# EAGLE schematic untitled (EAGLE 8.7.0)
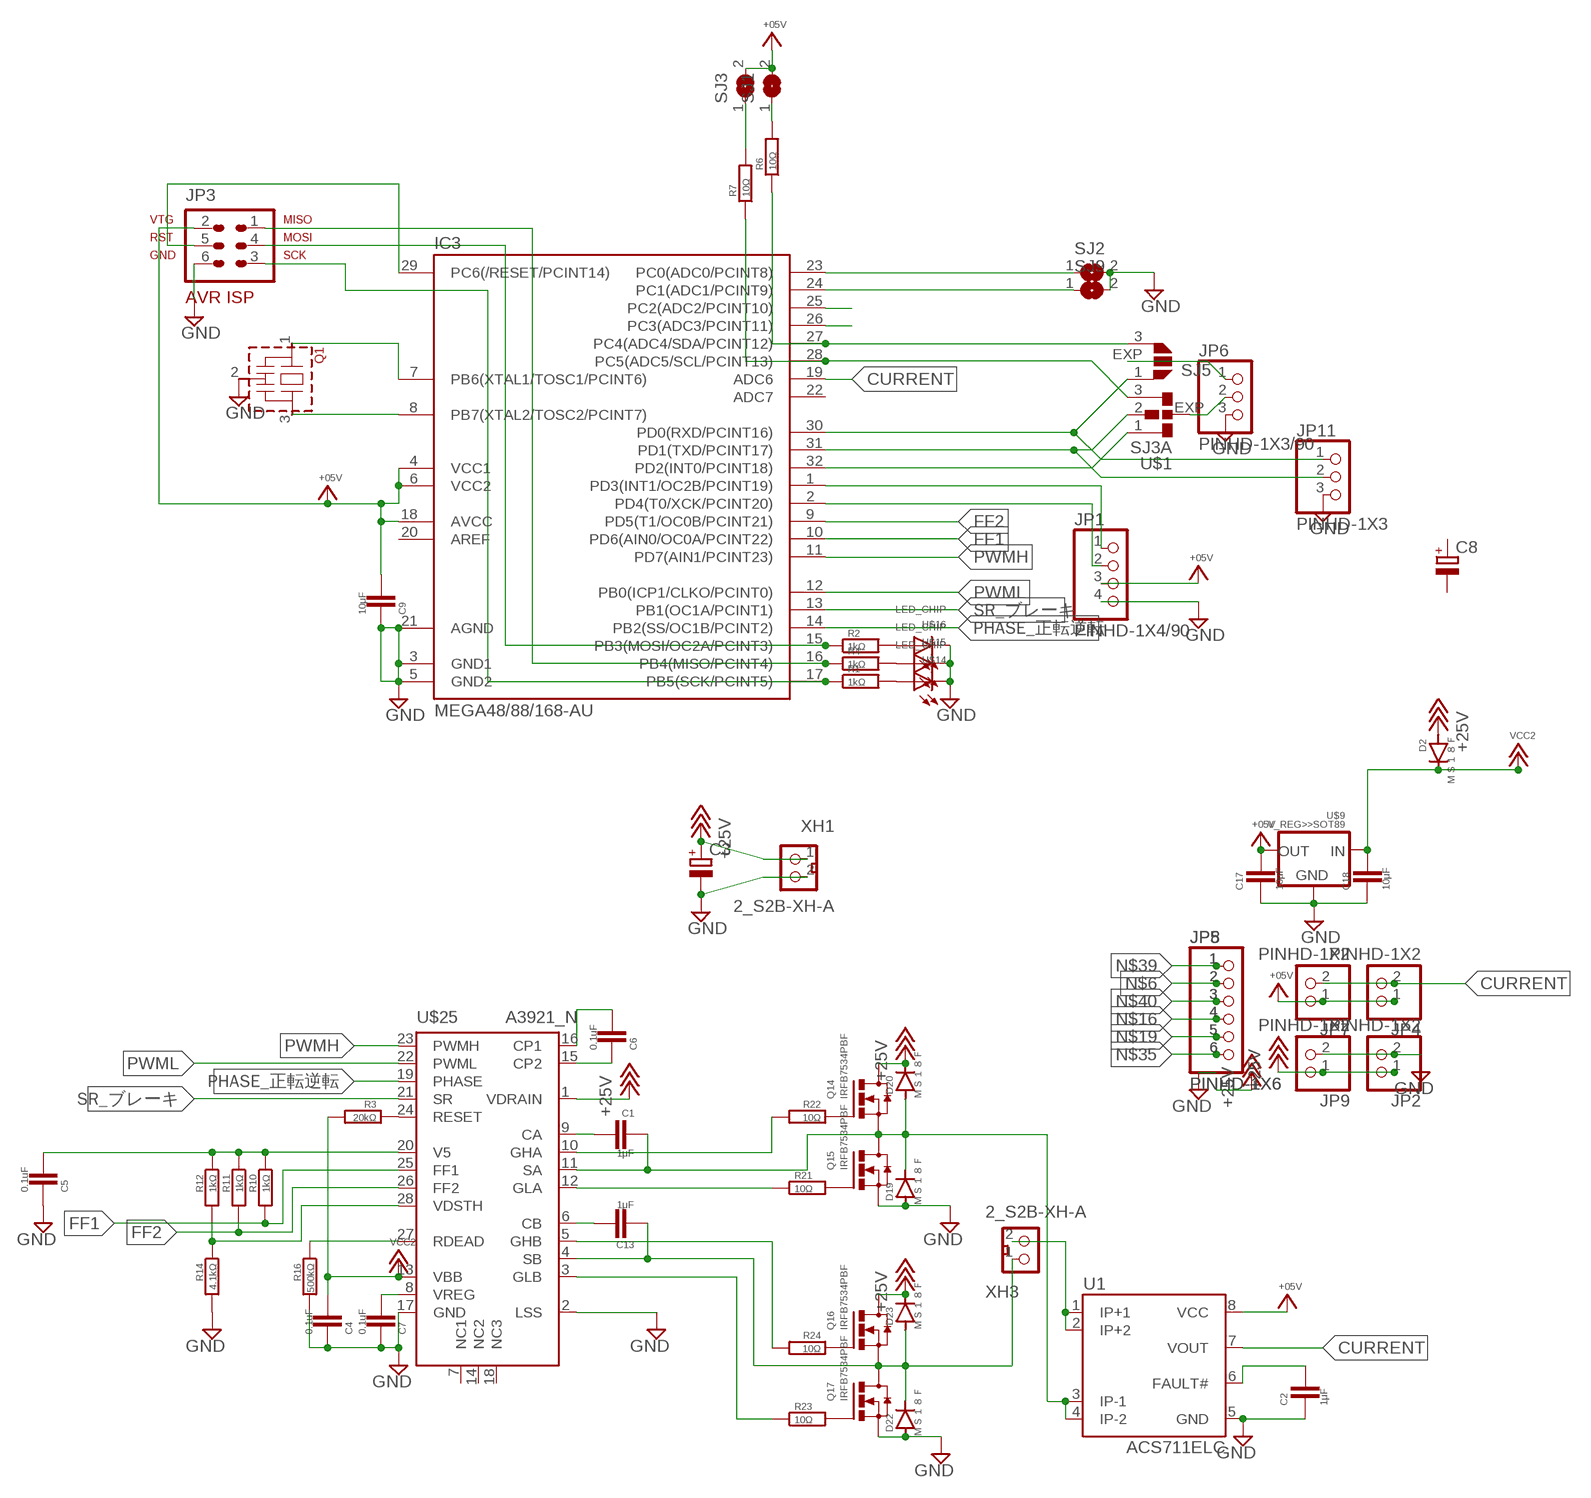
[diagram p0: schematic, sheet 1]

## Parts
C1  1μF  CAPACITOR>>2012  [2012]
C2  1μF  CAPACITOR>>2012  [2012]
C3  CPOL-EUUD-6,3X8,8  [UD-6,3X5,8_NICHICON]
C4  0.1uF  CAPACITOR>>2012  [2012]
C5  0.1uF  CAPACITOR>>2012  [2012]
C6  0.1uF  CAPACITOR>>2012  [2012]
C7  0.1uF  CAPACITOR>>2012  [2012]
C8  CPOL-EU150CLZ-1010  [150CLZ-1010]
C9  10μF  CAPACITOR>>2012  [2012]
C13  1μF  CAPACITOR>>2012  [2012]
C17  10μF  CAPACITOR>>2012  [2012]
C18  10μF  CAPACITOR>>2012  [2012]
D2  ＭＳ１８Ｆ  DIODE>>MS18F  [MS18F]
D19  ＭＳ１８Ｆ  DIODE>>MS18F  [MS18F]
D20  ＭＳ１８Ｆ  DIODE>>MS18F  [MS18F]
D22  ＭＳ１８Ｆ  DIODE>>MS18F  [MS18F]
D23  ＭＳ１８Ｆ  DIODE>>MS18F  [MS18F]
IC3  MEGA48/88/168-AU  [TQFP32-08]
JP1  PINHD-1X4/90  [1X04/90]
JP2  PINHD-1X2  [1X02]
JP3  AVR-ISP-6  [AVR-ISP-6]
JP4  PINHD-1X2  [1X02]
JP5  PINHD-1X6  [1X06]
JP6  PINHD-1X3/90  [1X03/90]
JP7  PINHD-1X2  [1X02]
JP8  PINHD-1X6  [1X06]
JP9  PINHD-1X2  [1X02]
JP11  PINHD-1X3  [1X03]
Q1  CSTLS_G  [CSTLS_G8]
Q14  IRFB7534PBF  MOSFET_N>>TO252  [TO252]
Q15  IRFB7534PBF  MOSFET_N>>TO252  [TO252]
Q16  IRFB7534PBF  MOSFET_N>>TO252  [TO252]
Q17  IRFB7534PBF  MOSFET_N>>TO252  [TO252]
R1  1kΩ  REGISTER>>2012  [2012]
R2  1kΩ  REGISTER>>2012  [2012]
R3  20kΩ  REGISTER>>2012  [2012]
R4  1kΩ  REGISTER>>2012  [2012]
R6  10Ω  REGISTER>>2012  [2012]
R7  10Ω  REGISTER>>2012  [2012]
R10  1kΩ  REGISTER>>2012  [2012]
R11  1kΩ  REGISTER>>2012  [2012]
R12  1kΩ  REGISTER>>2012  [2012]
R14  4.1kΩ  REGISTER>>2012  [2012]
R16  500kΩ  REGISTER>>2012  [2012]
R21  10Ω  REGISTER>>2012  [2012]
R22  10Ω  REGISTER>>2012  [2012]
R23  10Ω  REGISTER>>2012  [2012]
R24  10Ω  REGISTER>>2012  [2012]
SJ1  SJSS  [SJ_B]
SJ2  SJSS  [SJ_B]
SJ3  SJSS  [SJ_B]
SJ5  SJ2  [SJ2_A]
SJ9  SJSS  [SJ_B]
U1  ACS711ELC  [SOIC8]
U$1  SJ3A  [SJ3_A]
U$9  V_REG>>SOT89  [SOT89]
U$14  LED_CHIP  [2012]
U$15  LED_CHIP  [2012]
U$16  LED_CHIP  [2012]
U$25  A3921_N  [TSSOP28_N]
XH1  2_S2B-XH-A  [S2B-XH-A]
XH3  2_S2B-XH-A  [S2B-XH-A]

## Nets
+5V: C9.1 C17.1 IC3.4(VCC1) IC3.6(VCC2) IC3.18(AVCC) JP1.3 JP3.2 JP4.1 JP7.1 SJ1.2 SJ3.2 U1.8(VCC) U$9.1(OUT) ; supply symbol labelled +05V
+18V: C3.+ D2.P$1(A) D20.P$2(C) D23.P$2(C) JP2.1 JP9.1 Q14.3(D) Q16.3(D) U$25.1(VDRAIN) XH1.1 ; supply symbol labelled +25V
CURRENT: IC3.19(ADC6) JP4.2 JP7.2 U1.7(VOUT)
FF1: IC3.10(PD6(AIN0/OC0A/PCINT22)) R10.2 U$25.25(FF1)
FF2: IC3.9(PD5(T1/OC0B/PCINT21)) R11.2 U$25.26(FF2)
GND: C2.2 C3.- C4.2 C5.2 C7.2 C9.2 C17.2 C18.2 D19.P$1(A) D22.P$1(A) IC3.3(GND1) IC3.5(GND2) IC3.21(AGND) JP1.4 JP2.2 JP3.6 JP6.3 JP9.2 JP11.3 Q1.2(VSS) Q15.2(S) Q17.2(S) R14.2 R16.2 SJ2.2 SJ9.2 U1.5(GND) U$9.2(GND) U$9.2.1(GND) U$14.P$2(C) U$15.P$2(C) U$16.P$2(C) U$25.2(LSS) U$25.17(GND) XH1.2
N$1: IC3.1(PD3(INT1/OC2B/PCINT19)) JP1.1
N$2: R6.2 SJ1.1
N$3: U1.1(IP+1) U1.2(IP+2) XH3.2
N$4: C6.1 U$25.16(CP1)
N$5: IC3.29(PC6(/RESET/PCINT14)) JP3.5
N$6: C13.2 D22.P$2(C) D23.P$1(A) JP5.2 JP8.2 Q16.2(S) Q17.3(D) U$25.4(SB) XH3.1
N$7: IC3.7(PB6(XTAL1/TOSC1/PCINT6)) Q1.1
N$8: IC3.8(PB7(XTAL2/TOSC2/PCINT7)) Q1.3
N$9: R1.2 U$14.P$1(A)
N$10: IC3.2(PD4(T0/XCK/PCINT20)) JP1.2
N$11: IC3.17(PB5(SCK/PCINT5)) JP3.3 R1.1
N$14: C1.1 U$25.9(CA)
N$15: R4.2 U$15.P$1(A)
N$16: JP5.4 JP8.4 R22.2 U$25.10(GHA)
N$17: R2.2 U$16.P$1(A)
N$18: JP6.2 U$1.EXP
N$19: C1.2 D19.P$2(C) D20.P$1(A) JP5.5 JP8.5 Q14.2(S) Q15.3(D) U1.3(IP-1) U1.4(IP-2) U$25.11(SA)
N$20: R7.2 SJ3.1
N$21: IC3.15(PB3(MOSI/OC2A/PCINT3)) JP3.4 R2.1
N$22: IC3.16(PB4(MISO/PCINT4)) JP3.1 R4.1
N$23: JP6.1 SJ5.EXP
N$24: IC3.32(PD2(INT0/PCINT18)) U$1.1
N$25: IC3.23(PC0(ADC0/PCINT8)) SJ2.1
N$26: IC3.24(PC1(ADC1/PCINT9)) SJ9.1
N$27: IC3.31(PD1(TXD/PCINT17)) JP11.2 U$1.2
N$28: IC3.30(PD0(RXD/PCINT16)) JP11.1 SJ5.1
N$29: C6.2 U$25.15(CP2)
N$30: IC3.28(PC5(ADC5/SCL/PCINT13)) R7.1 U$1.3
N$31: IC3.27(PC4(ADC4/SDA/PCINT12)) R6.1 SJ5.3
N$32: IC3.25(PC2(ADC2/PCINT10))
N$33: IC3.26(PC3(ADC3/PCINT11))
N$35: JP5.6 JP8.6 R21.1 U$25.12(GLA)
N$36: R3.1 U$25.24(RESET)
N$37: C7.1 U$25.8(VREG)
N$39: JP5.1 JP8.1 R24.2 U$25.5(GHB)
N$40: JP5.3 JP8.3 R23.1 U$25.3(GLB)
N$41: C13.1 U$25.6(CB)
N$43: R12.2 R14.1 U$25.28(VDSTH)
N$50: Q15.1(G) R21.2
N$51: R16.1 U$25.27(RDEAD)
N$52: C2.1 U1.6(FAULT#)
N$54: Q14.1(G) R22.1
N$56: Q17.1(G) R23.2
N$60: Q16.1(G) R24.1
PHASE_正転逆転: IC3.14(PB2(SS/OC1B/PCINT2)) U$25.19(PHASE)
PWMH: IC3.11(PD7(AIN1/PCINT23)) U$25.23(PWMH)
PWML: IC3.12(PB0(ICP1/CLKO/PCINT0)) U$25.22(PWML)
SR_ブレーキ: IC3.13(PB1(OC1A/PCINT1)) U$25.21(SR)
V5: C5.1 R10.1 R11.1 R12.1 U$25.20(V5)
VCC2: C4.1 C18.1 D2.P$2(C) R3.2 U$9.3(IN) U$25.13(VBB)
Unconnected: C8.+ C8.- IC3.20(AREF) IC3.22(ADC7) U$25.7(NC1) U$25.14(NC2) U$25.18(NC3)

## Library data of the parts
C1 C2 C4-C7 C9 C13 C17 C18 = !SMD:CAPACITOR>>
C3 C8 = !rcl:CPOL-EU: POLARIZED CAPACITOR, European symbol
D2 D19 D20 D22 D23 = !diode:DIODE>>: DIODE
IC3 = !avr:MEGA48/88/168
JP1 = !pinhead(ﾋﾟﾝﾍｯﾀﾞ):PINHD-1X4: PIN HEADER
JP2 JP4 JP7 JP9 = !pinhead(ﾋﾟﾝﾍｯﾀﾞ):PINHD-1X2: PIN HEADER
JP3 = !avr:AVR-ISP-6: AVR ISP-6 Serial Programming Header
JP5 JP8 = !pinhead(ﾋﾟﾝﾍｯﾀﾞ):PINHD-1X6: PIN HEADER
JP6 JP11 = !pinhead(ﾋﾟﾝﾍｯﾀﾞ):PINHD-1X3: PIN HEADER
Q1 = !murata-resonators(ｾﾗﾛｯｸ):CSTLS_G: Ceramic resonator 2.00 to 10.00 MHz
Q14-Q17 = !FET_transister_v-reg:MOSFET_N>>
R1-R4 R6 R7 R10-R12 R14 R16 R21-R24 = !SMD:REGISTER>>
SJ1-SJ3 SJ9 = !jumper:SJ: SMD solder JUMPER
SJ5 = !jumper:SJ2: SMD solder JUMPER
U1 = allegro:ACS711E: SENSOR CURRENT 3.3V 8-SOIC tested: YES (etherbotix)
U$1 = !jumper:SJ3
U$9 = !FET_transister_v-reg:V_REG>>
U$14-U$16 = !led:LED_CHIP
U$25 = !irs(GateDriver):A3921_N
XH1 XH3 = !con-xh:2_: Wire-to-Board 2.5mm pitch top mount connector Source: http://www.jst-mfg.com/product/pdf/jpn/XH.pdf http://www.jst-mfg.com/product/detail.php?series=277